# Altium schematic sheet Gyro.SchDoc
size A4; SheetNumber: 9; SheetTotal: 11
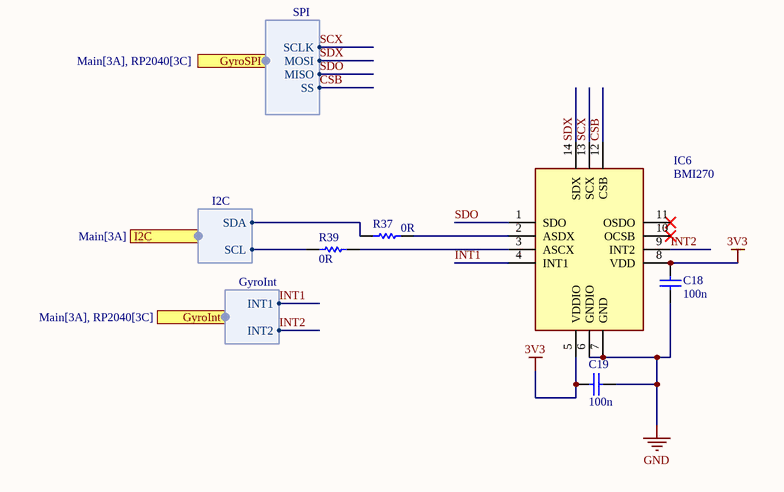
[diagram p0: Gyro.SchDoc]

## Parts
C18  100n  [CAPC0603(1608)55_N]
C19  100n  [CAPC0603(1608)55_N]
IC6  BMI270  [QFN50P300X250X87-14N]
R37  0R  [RESC1005X40X25NL05T10]
R39  0R  [RESC1005X40X25NL05T10]

## Ports
GyroInt (harness GyroInt, see Main[3A], RP2040[3C]), GyroSPI (harness SPI, see Main[3A], RP2040[3C]), I2C (harness I2C, see Main[3A])

## Harnesses
SPI: SS, MISO, MOSI, SCLK
GyroInt: INT1, INT2
I2C: SDA, SCL

## Nets
3V3: C18.2 C19.2 IC6.5(VDDIO) IC6.8(VDD)
GND: C18.1 C19.1 IC6.6(GNDIO) IC6.7(GND)
CSB: IC6.12(CSB) ; port GyroSPI.SS
INT1: IC6.4(INT1) ; port GyroInt.INT1
INT2: IC6.9(INT2) ; port GyroInt.INT2
SCX: IC6.13(SCX) ; port GyroSPI.SCLK
SDO: IC6.1(SDO) ; port GyroSPI.MISO
SDX: IC6.14(SDX) ; port GyroSPI.MOSI
NetIC6_2: IC6.2(ASDX) R37.2
NetIC6_3: IC6.3(ASCX) R39.2
NetR37_1: R37.1 ; port I2C.SDA
NetR39_1: R39.1 ; port I2C.SCL

Not connected (* = marked no-connect by the designer): IC6 10(OCSB)* 11(OSDO)*

## Library data of the parts
C18 C19 = Cap 100n: Keramikvielschichtkondensator, SMD, Baureihe MC, ± 20%; Manufacturer: Multicomp; OC_FARNELL: 1759038; Value: 100n; PackageReference: 0603
IC6 = BMI270: Integrated Circuit; Manufacturer_Name: BOSCH; Datasheet Link: https://www.mouser.de/datasheet/2/783/BST-BMI270-FL000-1530947.pdf; Height: 0.87mm; Manufacturer_Part_Number: BMI270; Mouser Part Number: 262-BMI270; Mouser Price/Stock: https://www.mouser.co.uk/ProductDetail/Bosch-Sensortec/BMI270?qs=u16ybLDytRYIj%252BjQEee88A%3D%3D; Arrow Part Number: BMI270; Arrow Price/Stock: https://www.arrow.com/en/products/bmi270/bosch?region=nac
R37 R39 = CMP-1011-00001-2: Manufacturer: Yageo / Phycomp; Part Number: RC0402JR-070RL